# Altium schematic sheet LCD Cape.SchDoc: LCD Cape BeagleBone Black
size A; DrawnBy: Emile R.; Revision: A; SheetNumber: 1; SheetTotal: 1
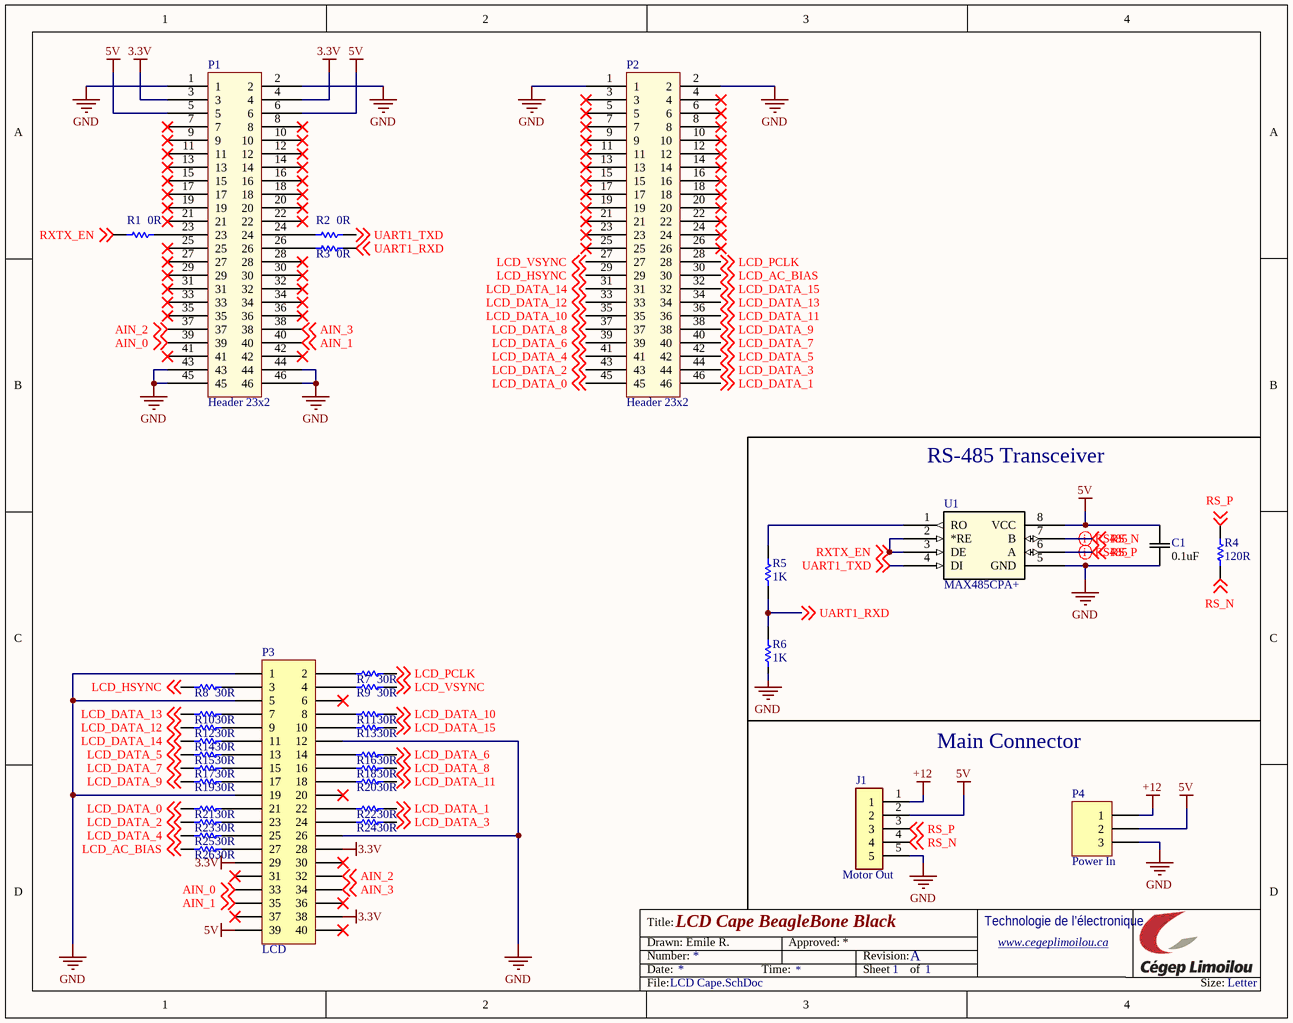
[diagram p0: LCD Cape.SchDoc]

## Parts
C1  value 0.1uF  [C1206]  (hidden comment: Capacitor 1206)
J1  Motor Out  [JST 5POS 2.5mm 90°]
P1  Header 23x2  [Header 23x2]
P2  Header 23x2  [Header 23x2]
P3  LCD  [HDR2X20]
P4  Power In  [Weco 3]
R1  value 0R  [C1206]  (hidden comment: Res1)
R2  value 0R  [C1206]  (hidden comment: Res1)
R3  value 0R  [C1206]  (hidden comment: Res1)
R4  value 120R  [C1206]  (hidden comment: Res1)
R5  value 1K  [C1206]  (hidden comment: Res1)
R6  value 1K  [C1206]  (hidden comment: Res1)
R7  value 30R  [C1206]  (hidden comment: Res1)
R8  value 30R  [C1206]  (hidden comment: Res1)
R9  value 30R  [C1206]  (hidden comment: Res1)
R10  value 30R  [C1206]  (hidden comment: Res1)
R11  value 30R  [C1206]  (hidden comment: Res1)
R12  value 30R  [C1206]  (hidden comment: Res1)
R13  value 30R  [C1206]  (hidden comment: Res1)
R14  value 30R  [C1206]  (hidden comment: Res1)
R15  value 30R  [C1206]  (hidden comment: Res1)
R16  value 30R  [C1206]  (hidden comment: Res1)
R17  value 30R  [C1206]  (hidden comment: Res1)
R18  value 30R  [C1206]  (hidden comment: Res1)
R19  value 30R  [C1206]  (hidden comment: Res1)
R20  value 30R  [C1206]  (hidden comment: Res1)
R21  value 30R  [C1206]  (hidden comment: Res1)
R22  value 30R  [C1206]  (hidden comment: Res1)
R23  value 30R  [C1206]  (hidden comment: Res1)
R24  value 30R  [C1206]  (hidden comment: Res1)
R25  value 30R  [C1206]  (hidden comment: Res1)
R26  value 30R  [C1206]  (hidden comment: Res1)
U1  MAX485CPA+  [DIP 8 - 3D]

## Nets
3.3V: P1.3 P1.4 P3.28 P3.29 P3.38
5V: C1.2 J1.2 P1.5 P1.6 P3.39 P4.2 U1.8(VCC)
+12: J1.1 P4.1
GND: C1.1 J1.5 P1.1 P1.2 P1.43 P1.44 P1.45 P1.46 P2.1 P2.2 P3.1 P3.5 P3.12 P3.19 P3.26 P4.3 R6.2 U1.5(GND)
AIN_0: P1.39 P3.33 ; off-sheet AIN_0
AIN_1: P1.40 P3.35 ; off-sheet AIN_1
AIN_2: P1.37 P3.32 ; off-sheet AIN_2
AIN_3: P1.38 P3.34 ; off-sheet AIN_3
LCD_AC_BIAS: P2.30 R26.1 ; off-sheet LCD_AC_BIAS
LCD_DATA_0: P2.45 R21.1 ; off-sheet LCD_DATA_0
LCD_DATA_1: P2.46 R22.2 ; off-sheet LCD_DATA_1
LCD_DATA_2: P2.43 R23.1 ; off-sheet LCD_DATA_2
LCD_DATA_3: P2.44 R24.2 ; off-sheet LCD_DATA_3
LCD_DATA_4: P2.41 R25.1 ; off-sheet LCD_DATA_4
LCD_DATA_5: P2.42 R15.1 ; off-sheet LCD_DATA_5
LCD_DATA_6: P2.39 R16.2 ; off-sheet LCD_DATA_6
LCD_DATA_7: P2.40 R17.1 ; off-sheet LCD_DATA_7
LCD_DATA_8: P2.37 R18.2 ; off-sheet LCD_DATA_8
LCD_DATA_9: P2.38 R19.1 ; off-sheet LCD_DATA_9
LCD_DATA_10: P2.35 R11.2 ; off-sheet LCD_DATA_10
LCD_DATA_11: P2.36 R20.2 ; off-sheet LCD_DATA_11
LCD_DATA_12: P2.33 R12.1 ; off-sheet LCD_DATA_12
LCD_DATA_13: P2.34 R10.1 ; off-sheet LCD_DATA_13
LCD_DATA_14: P2.31 R14.1 ; off-sheet LCD_DATA_14
LCD_DATA_15: P2.32 R13.2 ; off-sheet LCD_DATA_15
LCD_HSYNC: P2.29 R8.1 ; off-sheet LCD_HSYNC
LCD_PCLK: P2.28 R7.2 ; off-sheet LCD_PCLK
LCD_VSYNC: P2.27 R9.2 ; off-sheet LCD_VSYNC
RS_N: J1.4 R4.2 U1.7(B) ; off-sheet RS_N
RS_P: J1.3 R4.1 U1.6(A) ; off-sheet RS_P
RXTX_EN: R1.1 U1.2(*RE) U1.3(DE) ; off-sheet RXTX_EN
UART1_RXD: R3.2 R5.2 R6.1 ; off-sheet UART1_RXD
UART1_TXD: R2.2 U1.4(DI) ; off-sheet UART1_TXD
NetP1_23: P1.23 R1.2
NetP1_24: P1.24 R2.1
NetP1_26: P1.26 R3.1
NetP3_2: P3.2 R7.1
NetP3_3: P3.3 R8.2
NetP3_4: P3.4 R9.1
NetP3_7: P3.7 R10.2
NetP3_8: P3.8 R11.1
NetP3_9: P3.9 R12.2
NetP3_10: P3.10 R13.1
NetP3_11: P3.11 R14.2
NetP3_13: P3.13 R15.2
NetP3_14: P3.14 R16.1
NetP3_15: P3.15 R17.2
NetP3_16: P3.16 R18.1
NetP3_17: P3.17 R19.2
NetP3_18: P3.18 R20.1
NetP3_21: P3.21 R21.2
NetP3_22: P3.22 R22.1
NetP3_23: P3.23 R23.2
NetP3_24: P3.24 R24.1
NetP3_25: P3.25 R25.2
NetP3_27: P3.27 R26.2
NetR5_1: R5.1 U1.1(RO)

Not connected (* = marked no-connect by the designer): P1 7* 8* 9* 10* 11* 12* 13* 14* 15* 16* 17* 18* 19* 20* 21* 22* 25* 27* 28* 29* 30* 31* 32* 33* 34* 35* 36* 41* 42*; P2 3* 4* 5* 6* 7* 8* 9* 10* 11* 12* 13* 14* 15* 16* 17* 18* 19* 20* 21* 22* 23* 24* 25* 26*; P3 6* 20* 30* 31* 36* 37* 40*

## Layout directives
differential pair: RS_N, RS_P

## Notes on the sheet
- RS-485 Transceiver
- Main Connector
- Title:
- Number:
- Date:
- Drawn:
- Time:
- Approved:
- Revision:
- Sheet
- of
- Technologie de l’électronique
- www.cegeplimoilou.ca
- File:
- Size:
- Letter

## Library data of the parts
C1 = Capacitor 1206: Capacitor SMD 1206; Manufacturer_Part_Number: 12065A820JAT2A; Vendor: AVX Corporation; Built_By: EMA_UL_Team; Type: DEV; Copyright: Copyright (C) 2018 Accelerated Designs. All rights reserved; RefDes: RefDes
J1 = JST 5POS: Connector; Manufacturer_Name: JST (JAPAN SOLDERLESS TERMINALS); Manufacturer_Part_Number: S5B-XH-A-1(LF)(SN); Datasheet Link: http://www.jst-mfg.com/product/pdf/eng/eXH.pdf; Height: 6.1mm
P3 = Header 20X2: Header, 20-Pin, Dual row; LatestRevisionDate: 17-Jul-2002; LatestRevisionNote: Re-released for DXP Platform.; Publisher: Altium Limited
P4 = Header 3: Header, 3-Pin; LatestRevisionDate: 17-Jul-2002; LatestRevisionNote: Re-released for DXP Platform.; Publisher: Altium Limited
R1-R26 = Res1: Resistor; Published: 8-Jun-2000; LatestRevisionDate: 17-Jul-2002; LatestRevisionNote: Re-released for DXP Platform.; PackageReference: AXIAL-0.3; Publisher: Altium Limited; PackageDescription: Axial Device, Thru-Hole; 2 Leads; 0.3 in Pin Spacing
U1 = MAX485CPA+: RS485 Communication; Vendor: Maxim Integrated Products; Built_By: EMA_UL_Team; Manufacturer_Part_Number: MAX485CPA+; Copyright: Copyright (C) 2018 Accelerated Designs. All rights reserved; RefDes: RefDes; Type: DEV; Value: Value